# EAGLE design CH340G Basic-5V (EAGLE 7.2.0)
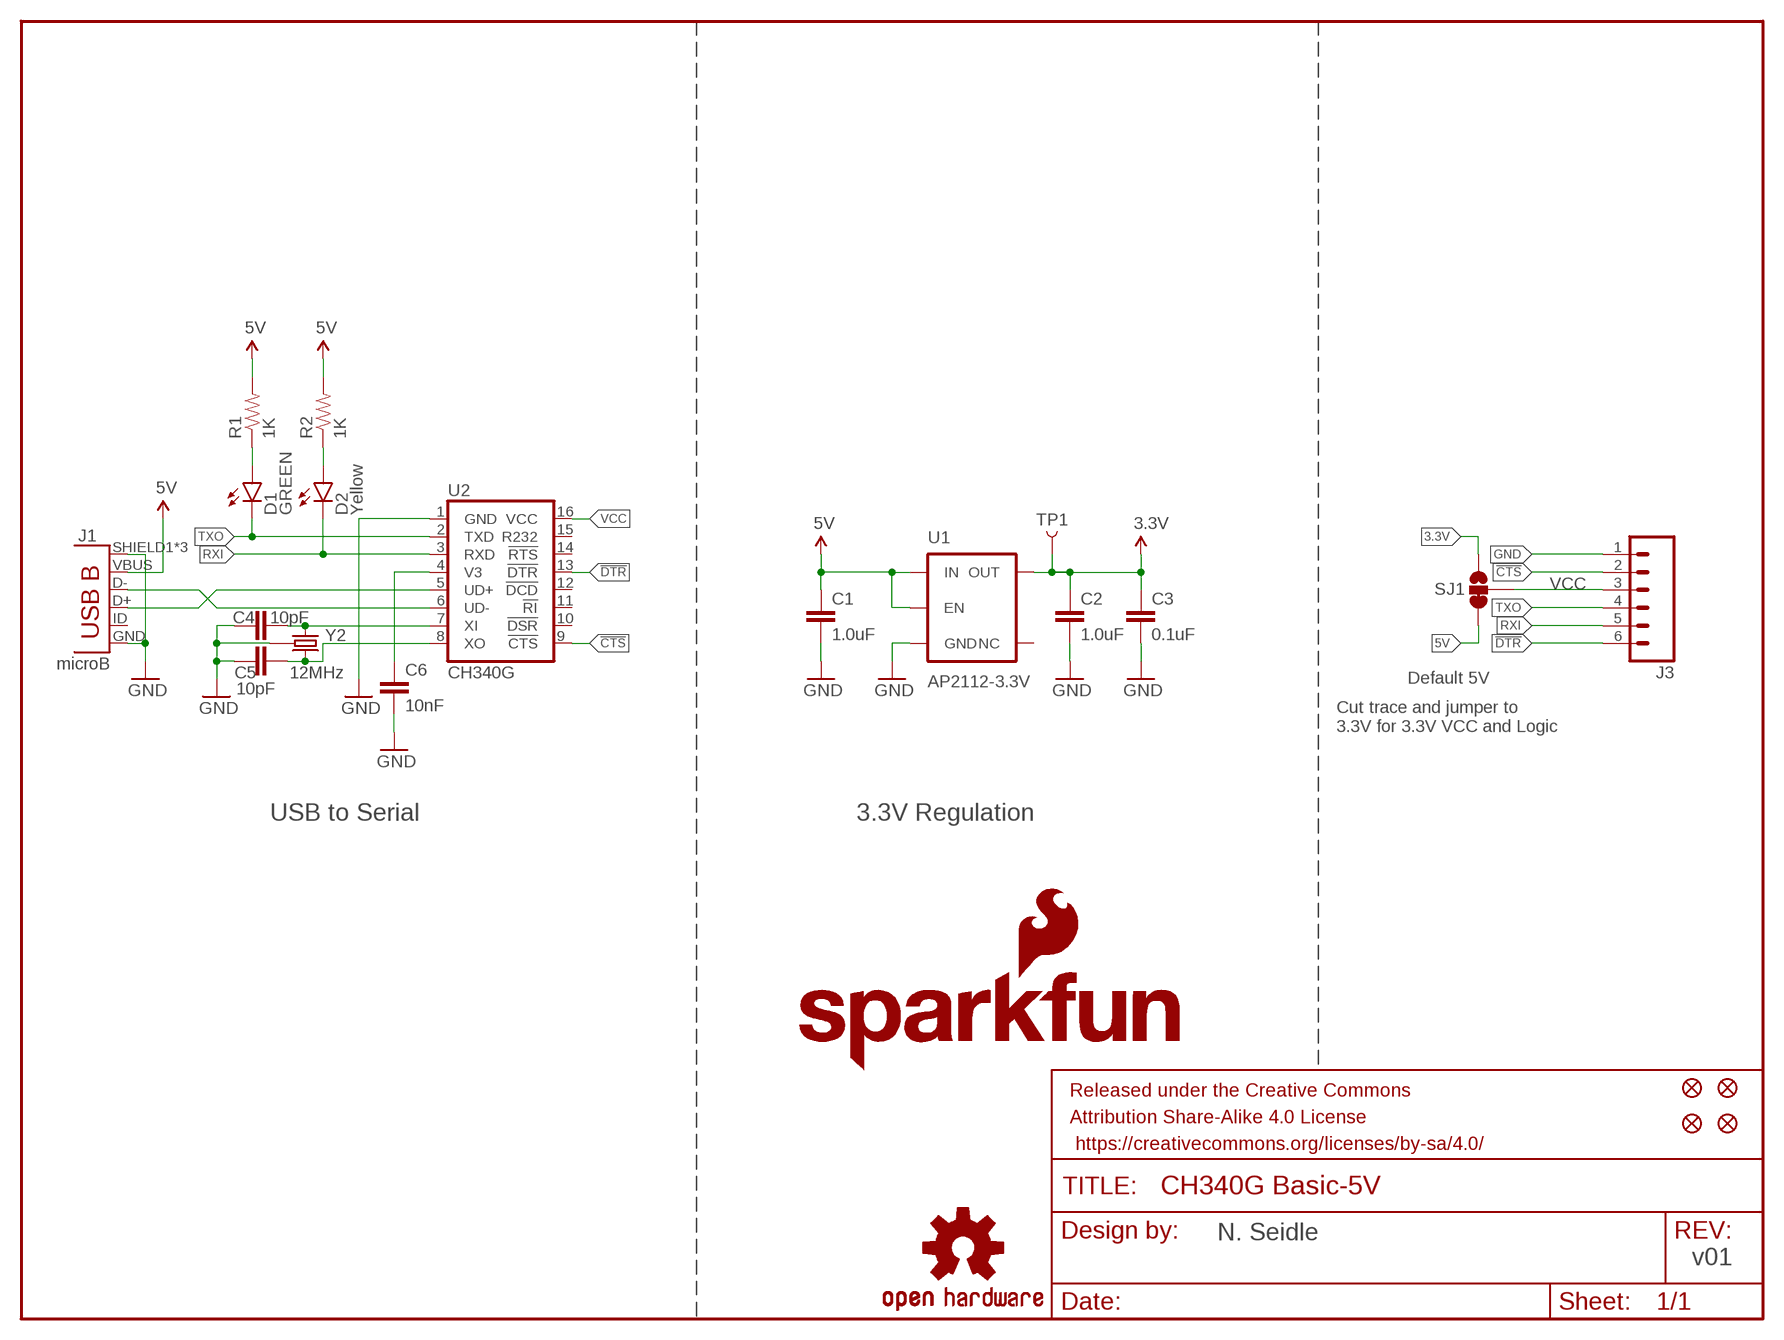
[diagram p0: schematic, sheet 1]

## Parts
C1  1.0uF  1.0UF-16V-10%(0603)  [0603-CAP]
C2  1.0uF  1.0UF-16V-10%(0603)  [0603-CAP]
C3  0.1uF  0.1UF-25V(+80/-20%)(0603)  [0603-CAP]
C4  10pF  10PF-50V-5%(0603)  [0603-CAP]
C5  10pF  10PF-50V-5%(0603)  [0603-CAP]
C6  10nF  10NF/10000PF-50V-10%(0603)  [0603-CAP]
D1  GREEN  LED-GREEN0603  [LED-0603]
D2  Yellow  LED-YELLOW0603  [LED-0603]
FRAME1  FRAME-LETTER  [CREATIVE_COMMONS]
J1  microB  USB-MICROB"  [USB-B-MICRO-SMD_V03]
J3  M06SMD-FEMALE-V2  [1X06-SMD-FEMALE-V2]
JP3  FIDUCIAL1X2  [FIDUCIAL-1X2]
JP4  FIDUCIAL1X2  [FIDUCIAL-1X2]
JP5  FIDUCIAL1X2  [FIDUCIAL-1X2]
JP6  FIDUCIAL1X2  [FIDUCIAL-1X2]
LOGO1  OSHW-LOGOS  [OSHW-LOGO-S]
LOGO2  SFE_LOGO_FLAME.1_INCH  [SFE_LOGO_FLAME_.1]
LOGO3  SFE_LOGO_NAME.1_INCH  [SFE_LOGO_NAME_.1]
R1  1K  1KOHM-1/10W-1%(0603)  [0603-RES]
R2  1K  1KOHM-1/10W-1%(0603)  [0603-RES]
SJ1  SOLDERJUMPER_2WAYS  [SJ_3]
TP1  3.3V TP  TEST-POINT3  [PAD.03X.03]
U1  AP2112-3.3V  V_REG_AP2112K-3.3V  [SOT23-5]
U2  CH340G  CH340GSMD  [SO016]
Y2  12MHz  CRYSTAL-GROUNDED3.2X2.5  [CRYSTAL-SMD-3.2X2.5]

## Nets
3.3V [power]: C2.1 C3.1 SJ1.3 TP1.P$1 U1.5(OUT)
5V: C1.1 J1.VBUS R1.2 R2.2 SJ1.1 U1.1(IN) U1.3(EN)
!CTS: J3.2 U2.9(!CTS)
!DTR: J3.6 U2.13(!DTR)
GND [power]: C1.2 C2.2 C3.2 C4.1 C5.1 C6.2 J1.GND J1.SHIELD1(SHIELD) J1.SHIELD2(SHIELD) J1.SHIELD3(SHIELD) J3.1 U1.2(GND) U2.1(GND) Y2.2(GND) Y2.4(GND)
N$1: D1.A R1.1
N$2: D2.A R2.1
N$3: C5.2 U2.8(XO) Y2.3
N$4: C4.2 U2.7(XI) Y2.1
N$6: J1.D- U2.6(UD-)
N$7: J1.D+ U2.5(UD+)
RXI: D2.C J3.5 U2.3(RXD)
TXO: D1.C J3.4 U2.2(TXD)
V3: C6.1 U2.4(V3)
VCC: J3.3 SJ1.2 U2.16(VCC)
Unconnected: J1.ID(USBID) U1.4(NC) U2.10(!DSR) U2.11(!RI) U2.12(!DCD) U2.14(!RTS) U2.15(R232)

## Notes on the sheet
- Default 5V
- Cut trace and jumper to
  3.3V for 3.3V VCC and Logic
- USB to Serial | 3.3V Regulation
- N. Seidle
- v01

## Library data of the parts
C1 C2 = SparkFun-Capacitors:1.0UF-16V-10%(0603): CAP-00868; PROD_ID: CAP-00868
C3 = SparkFun-Capacitors:0.1UF-25V(+80/-20%)(0603): CAP-00810 Ceramic Standard decoupling cap; PROD_ID: CAP-00810
C4 C5 = SparkFun-Capacitors:10PF-50V-5%(0603): CAP-11812; PROD_ID: CAP-11812
C6 = SparkFun-Capacitors:10NF/10000PF-50V-10%(0603): CAP-00867; PROD_ID: CAP-00867
D1 = SparkFun-LED:LED-GREEN: Various green LEDs Green LEDs used in SFE Production 0603- DIO-00821 LARGE- DIO-00862 LILYPAD- DIO-09910; PROD_ID: DIO-00821
D2 = SparkFun-LED:LED-YELLOW: Yellow SMD LEDs LilyPad 1206- DIO-09909 0603- DIO-09003 "SMART" means more efficient and expensive; PROD_ID: DIO-09003
FRAME1 = SparkFun-Aesthetics:FRAME-LETTER: Schematic Frame Standard 8.5x11 US Letter frame
J1 = SparkFun-Connectors:USB-MICROB; PROD_ID: CONN-11752
J3 = SparkFun-Connectors:M06: Header 6 Standard 6-pin 0.1" header. Use with straight break away headers (SKU : PRT-00116), right angle break away headers (PRT-00553), swiss pins (PRT-00743), machine pins (PRT-00117), and female headers (PRT-00115). Molex polarized connector foot print use with SKU : PRT-08094 with associated crimp pins and housings. NOTES ON THE VARIANTS LOCK and LOCK_LONGPADS... This footprint was designed to help hold the alignment of a through-hole component (i.e. 6-pin header) while soldering it into place. You may notice that each hole has been shifted either up or down by 0.005 of an inch from it's more standard position (which is a perfectly straight line). This slight alteration caused the pins (the squares in the middle) to touch the edges of the holes. Because they are alternating, it causes a "brace" to hold the component in place. 0.005 has proven to be the perfect amount of "off-center" position when using our standard breakaway headers. Although looks a little odd when you look at the bare footprint, once you have a header in there, the alteration is very hard to notice. Also,if you push a header all the way into place, it is covered up entirely on the bottom side. This idea of altering the position of holes to aid alignment will be further integrated into the Sparkfun Library for other footprints. It can help hold any component with 3 or more connection pins.; PROD_ID: CONN-09668
JP3-JP6 = SparkFun:FIDUCIAL: Fiducial Alignment Points Various fiducial points for machine vision alignment.
LOGO1 = SparkFun-Aesthetics:OSHW-LOGO: Open Source Hardware Logo This logo indicates the piece of hardware it is found on incorporates a OSHW license and/or adheres to the definition of open source hardware found here: http://freedomdefined.org/OSHW
LOGO2 = SparkFun-Aesthetics:SFE_LOGO_FLAME: SFE Logo, flame only This is the SparkFun flame logo. The logo on the schematic will always be the same size; the package variant is the height of the flame. Default layer for the logo on the board is tSilk.
LOGO3 = SparkFun-Aesthetics:SFE_LOGO_NAME: SFE Logo, name only This is the SparkFun name logo. The logo on the schematic will always be the same size; the package variant is the height of the flame part of the logo (or the height the flame would be, if it were drawn). Default layer for the logo on the board is tSilk.
R1 R2 = SparkFun-Resistors:1KOHM-1/10W-1%(0603): RES-07856; PROD_ID: RES-07856
SJ1 = SparkFun:SOLDERJUMPER_2WAY: Solder Jumper 2 way solder jumper
TP1 = SparkFun-Passives:TEST-POINT: Bare copper test points for troubleshooting or ICT
U1 = SparkFun-PowerIC:V_REG_AP2112: AP2112 - 600mA CMOS LDO Regulator w/ Enable The AP2112 is CMOS process low dropout linear regulator with enable function, the regulator delivers a guaranteed 600mA (min.) continuous load current. Features Output Voltage Accuracy: ±1.5% Output Current: 600mA (Min.) Foldback Short Current Protection: 50mA Enable Function to Turn ON/OFF VOUT Low Dropout Voltage (3.3V): 250mV (Typ.) @IOUT=600mA Excellent Load Regulation: 0.2%/A (Typ.) Excellent Line Regulation: 0.02%/V (Typ.) Low Quiescent Current: 55μA (Typ.) Low Standby Current: 0.01μA (Typ.) Low Output Noise: 50μVRMS PSRR: 100Hz -65dB, 1kHz -65dB OTSD Protection Stable with 1.0μF Flexible Cap: Ceramic, Tantalum and Aluminum Electrolytic Operation Temperature Range: -40°C to 85°C ESD: MM 400V, HBM 4000V; PROD_ID: VREG-12457; VALUE: 3.3V
U2 = SparkFun-DigitalIC:CH340G: A simple USB 2.0 to Serial IC.; PROD_ID: IC-13498
Y2 = USB Basic:CRYSTAL-GROUNDED: Small, 3.2x2.5mm, SMD Crystal; PROD_ID: XTAL-13518

## Net classes
1 power: width 0.178 mm

## Board
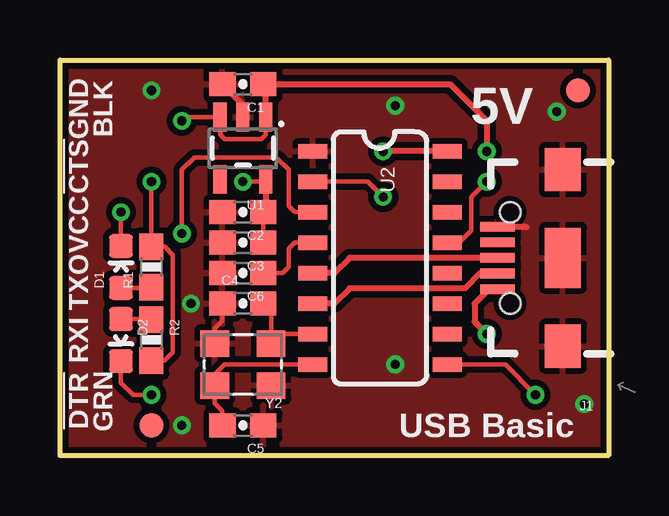
[diagram p1: board, top side]
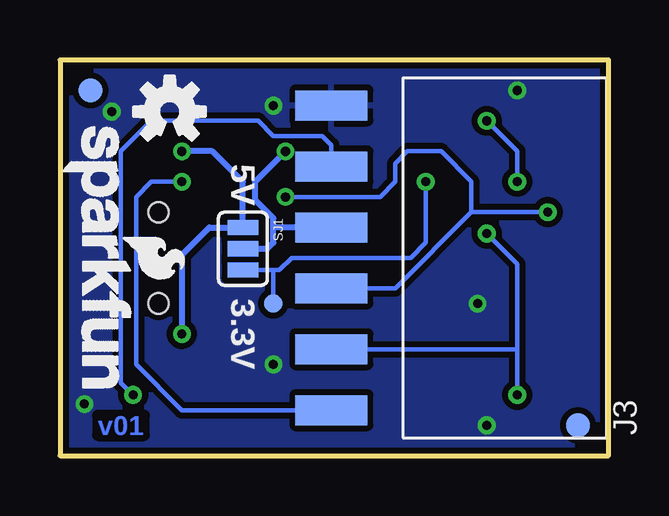
[diagram p2: board, bottom side, seen from below]

Size 22.86 x 16.51 mm. Coordinates in mm from the lower left corner, seen from the top.
Outline: 0,16.51 22.86,16.51 22.86,0 0,0 0,16.51
Copper layers (1*16): Top 0.035mm / dielectric 1.5mm / Bottom 0.035mm
Design rules "SparkFun-2-layer-TIGHT": minimum track width 7mil, minimum drill 15mil, track to track 7mil, track to pad 7mil, pad to pad 7mil, via to via 7mil, smd to smd 7mil, copper to edge 7mil, drill to drill 7mil, minimum pad ring 7mil, minimum via ring 7mil, stop-mask expansion 4mil, vias tented up to drill 20mil, thermal gap 10mil

### Footprints (pad centres in the part's own frame; a part is rotated, then mirrored left to right if it is on the bottom)
0603-CAP = smd 1.1 x 1: 1 -0.85,0; 2 0.85,0
LED-0603 = smd 1 x 1: A 0,-0.877; C 0,0.877
USB-B-MICRO-SMD_V03 = smd 1.45 x 0.4: D+ 2.725,0; D- 2.725,0.65; GND 2.725,-1.3; ID 2.725,-0.65; VBUS 2.725,1.3 | smd 1.5 x 1.8: SHIELD1 0,3.685; SHIELD2 0,-3.685 | smd 1.5 x 2.5: SHIELD3 0,0 | hole 0.85: 2.2,1.9; 2.2,-1.9
1X06-SMD-FEMALE-V2 = smd 1.25 x 3: 1 6.35,3.425; 2 3.81,3.425; 3 1.27,3.425; 4 -1.27,3.425; 5 -3.81,3.425; 6 -6.35,3.425
FIDUCIAL-1X2 = smd 1 x 1: 1 0,0
0603-RES = smd 1.1 x 1: 1 -0.85,0; 2 0.85,0
SJ_3 = smd 0.635 x 1.27: 1 -0.889,0; 2 0,0; 3 0.889,0
PAD.03X.03 = smd 0.762 x 0.762: P$1 0,0
SOT23-5 = smd 0.55 x 1.2: 1 -0.95,-1.3; 2 0,-1.3; 3 0.95,-1.3; 4 0.95,1.3; 5 -0.95,1.3
SO016 = smd 0.6 x 1.2: 1 -4.445,-2.8; 2 -3.175,-2.8; 3 -1.905,-2.8; 4 -0.635,-2.8; 5 0.635,-2.8; 6 1.905,-2.8; 7 3.175,-2.8; 8 4.445,-2.8; 9 4.445,2.8; 10 3.175,2.8; 11 1.905,2.8; 12 0.635,2.8; 13 -0.635,2.8; 14 -1.905,2.8; 15 -3.175,2.8; 16 -4.445,2.8
CRYSTAL-SMD-3.2X2.5 = smd 1.2 x 1.1: 1 -1.175,-0.875; 2 1.175,-0.875; 3 1.175,0.875; 4 -1.175,0.875

### Placement (x,y rotation side)
C1  7.62,15.49 180 top
C2  7.62,10.16 180 top
C3  7.62,8.89 180 top
C4  7.62,6.35 0 top
C5  7.62,1.27 180 top
C6  7.62,7.62 180 top
D1  2.54,7.87 0 top
D2  2.54,4.83 180 top
FRAME1  -8.31,-17.78 0 top  (outside the outline)
J1  20.95,8.26 180 top
J3  8.13,8.26 90 bottom
JP3  3.81,1.27 0 top
JP4  21.59,15.24 0 top
JP5  1.27,1.27 0 bottom
JP6  21.59,15.24 0 bottom
LOGO1  18.29,14.35 0 bottom
LOGO2  20.57,9.4 270 bottom
LOGO3  23.24,14.22 270 bottom
R1  3.81,7.87 90 top
R2  3.81,4.83 270 top
SJ1  15.24,8.64 270 bottom
TP1  13.97,6.35 0 bottom
U1  7.62,12.83 180 top
U2  13.34,8.26 270 top
Y2  7.62,3.81 180 top

### Tracks (layer width: path | path; a pad name or v marks a point on that pad's centre or on a via)
3.3V  (via drill 0.38)
  Top 0.178: v7.62,11.43 8.54,11.43 | C3.1 C2.1
  Top 0.254: C2.1 8.57,10.26 U1.5 8.54,11.5 8.54,11.43
  Bottom 0.178: SJ1.3 13.97,7.75 | 13.97,7.75 13.72,7.75 13.21,8.26 8.26,8.26 7.62,8.89 v7.62,11.43 | TP1.P$1 13.97,7.75
5V  (via drill 0.38)
  Top 0.178: 5.11,14 v5.08,13.97 5.24,14.13 U1.3 6.67,13.4 6.86,13.21 8.38,13.21 8.57,13.4 U1.1 | R2.2 4.36,3.98 4.7,4.32 4.7,8.38 4.36,8.72 R1.2 v3.81,11.43
  Top 0.254: v17.78,12.7 17.78,13.97 16.26,15.49 C1.1 8.57,15.39 U1.1 | J1.VBUS 17.88,6.96 17.27,6.35 17.27,5.59 v17.78,5.08
  Bottom 0.178: v3.81,11.43 3.81,12.7 v5.08,13.97
  Bottom 0.254: v17.78,5.08 17.78,8.38 16.64,9.53 SJ1.1 15.24,11.43 16.51,12.7 v17.78,12.7
!CTS  (via drill 0.38)
  Top 0.178: U2.9 18.54,3.81 v19.81,2.54
  Bottom 0.178: J3.2 11.55,12.95 11.94,13.34 13.97,13.34 14.61,13.97 19.05,13.97 20.32,12.7 20.32,3.05 v19.81,2.54
!DTR  (via drill 0.38)
  Top 0.178: U2.13 16.64,8.89 17.14,9.4 17.14,10.79 v17.78,11.43
  Bottom 0.178: v17.78,11.43 19.05,11.43 19.68,10.79 19.68,3.81 17.78,1.91 J3.6
GND  (via drill 0.38)
  Top 0.178: C4.1 6.77,5.63 6.45,5.3 Y2.2
  Top 0.254: J1.GND 19.4,9.55 19.43,9.53 | U1.2 7.62,14.64 C1.2
  other vias: 13.97,14.61 3.81,15.24 13.97,3.81 5.46,6.35 20.7,14.35 21.84,2.16 5.08,1.27
  pour Bottom (isolate 0.254): 0,-0.03 0,16.51 22.86,16.51 22.86,-0.03
  pour Top (isolate 0.254): 0,-0.03 0,16.51 22.86,16.51 22.86,-0.03
N$1
  Top 0.178: D1.A 3.78,7 R1.1
N$2
  Top 0.178: D2.A 3.78,5.7 R2.1
N$3
  Top 0.178: C5.2 6.77,1.87 6.45,2.19 Y2.3 6.45,3.4 6.86,3.81 U2.8
N$4
  Top 0.178: 8.47,6.01 C4.2 8.79,6.03 Y2.1 9.19,5.08 U2.7
N$6
  Top 0.254: J1.D- 17.5,7.61 16.88,6.99 12.06,6.99 11.43,6.35 U2.6
N$7
  Top 0.254: J1.D+ 12.06,8.26 11.43,7.62 U2.5
RXI  (via drill 0.38)
  Top 0.178: U2.3 9.78,10.16 9.53,10.41 9.53,11.94 9.02,12.45 5.59,12.45 5.08,11.94 v5.08,9.27 | v3.81,2.54 3.05,2.54 2.54,3.05 D2.C
  Bottom 0.178: v3.81,2.54 3.81,4.45 | 3.81,4.45 3.81,8 v5.08,9.27 | J3.5 3.81,4.45
TXO  (via drill 0.38)
  Top 0.178: U2.2 12.83,11.43 v13.46,10.79 | D1.C v2.54,10.16
  Bottom 0.178: v2.54,10.16 5.71,10.16 | 5.71,10.16 8.89,6.99 J3.4 | 5.71,10.16 5.71,11.43 6.99,12.7 8.38,12.7 8.89,12.19 8.89,11.43 9.53,10.79 v13.46,10.79
V3
  Top 0.178: C6.1 9.27,7.62 9.53,7.87 9.53,8.64 9.78,8.89 U2.4
VCC  (via drill 0.38)
  Top 0.254: U2.16 v13.46,12.7
  Bottom 0.254: SJ1.2 14.22,8.64 13.97,8.89 13.97,9.53 | 13.97,9.53 13.97,9.91 14.73,10.67 14.73,11.43 v13.46,12.7 | J3.3 13.97,9.53

### Text on the board
Bottom: v01
tPlace: 5V | GND | BLK | !CTS | VCC | TXO | RXI | !DTR | GRN | USB Basic
bPlace: 5V | 3.3V
tValues: Close
tDocu: N. Seidle